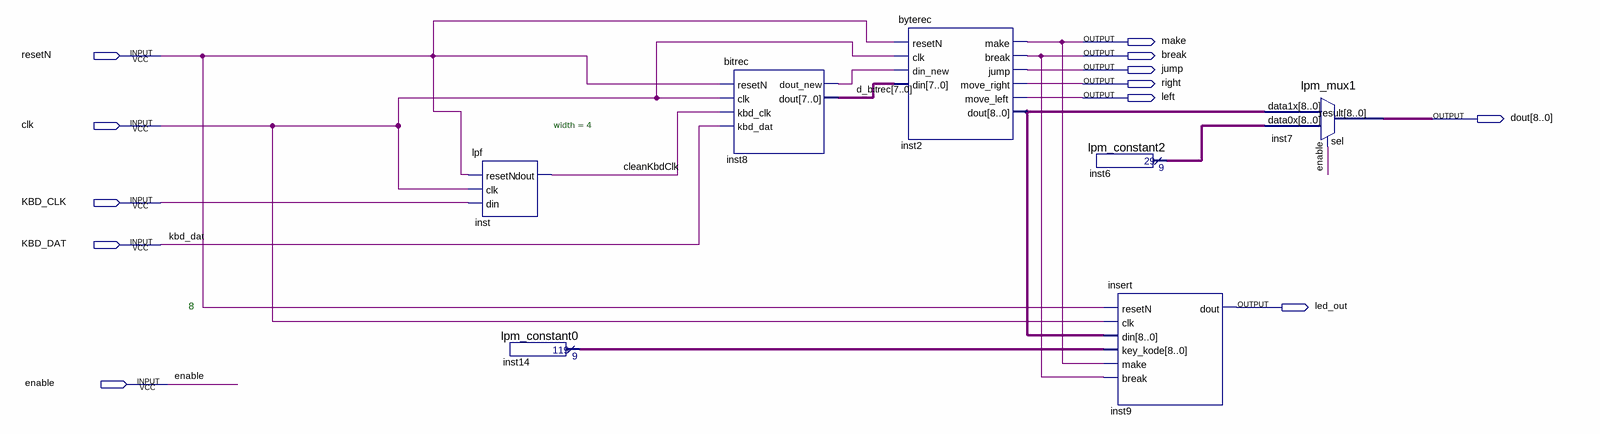
[diagram p0: schematic sheet]
// Quartus schematic KBD_final.bdf as structural Verilog: 7 symbols, 12 pins
module KBD_final (
  input  resetN,
  input  clk,
  input  KBD_CLK,
  input  KBD_DAT,
  input  enable,
  output make,
  output \break ,
  output jump,
  output right,
  output left,
  output [8:0] dout,
  output led_out
);

  wire cleanKbdClk, inst8_dout_new;
  wire [7:0] d_bitrec;
  wire [8:0] inst2_dout, inst6_result, inst14_result;

  lpf #(.width(4)) inst (.resetN(resetN), .clk(clk), .din(KBD_CLK), .dout(cleanKbdClk));
  lpm_constant0 inst14 (.result(inst14_result));
  bitrec inst8 (
    .resetN(resetN), .clk(clk), .kbd_clk(cleanKbdClk), .kbd_dat(KBD_DAT), .dout_new(inst8_dout_new),
    .dout(d_bitrec));
  byterec inst2 (
    .resetN(resetN), .clk(clk), .din_new(inst8_dout_new), .din(d_bitrec), .make(make), .\break (\break ),
    .jump(jump), .move_right(right), .move_left(left), .dout(inst2_dout));
  lpm_constant2 inst6 (.result(inst6_result));
  insert inst9 (
    .resetN(resetN), .clk(clk), .din(inst2_dout), .key_kode(inst14_result), .make(make), .\break (\break ),
    .dout(led_out));
  lpm_mux1 inst7 (.data1x(inst2_dout), .data0x(inst6_result), .sel(enable), .result(dout));

  // Notes on the sheet:
  //   8
endmodule
